# EAGLE design spacepwr (EAGLE 6.2)
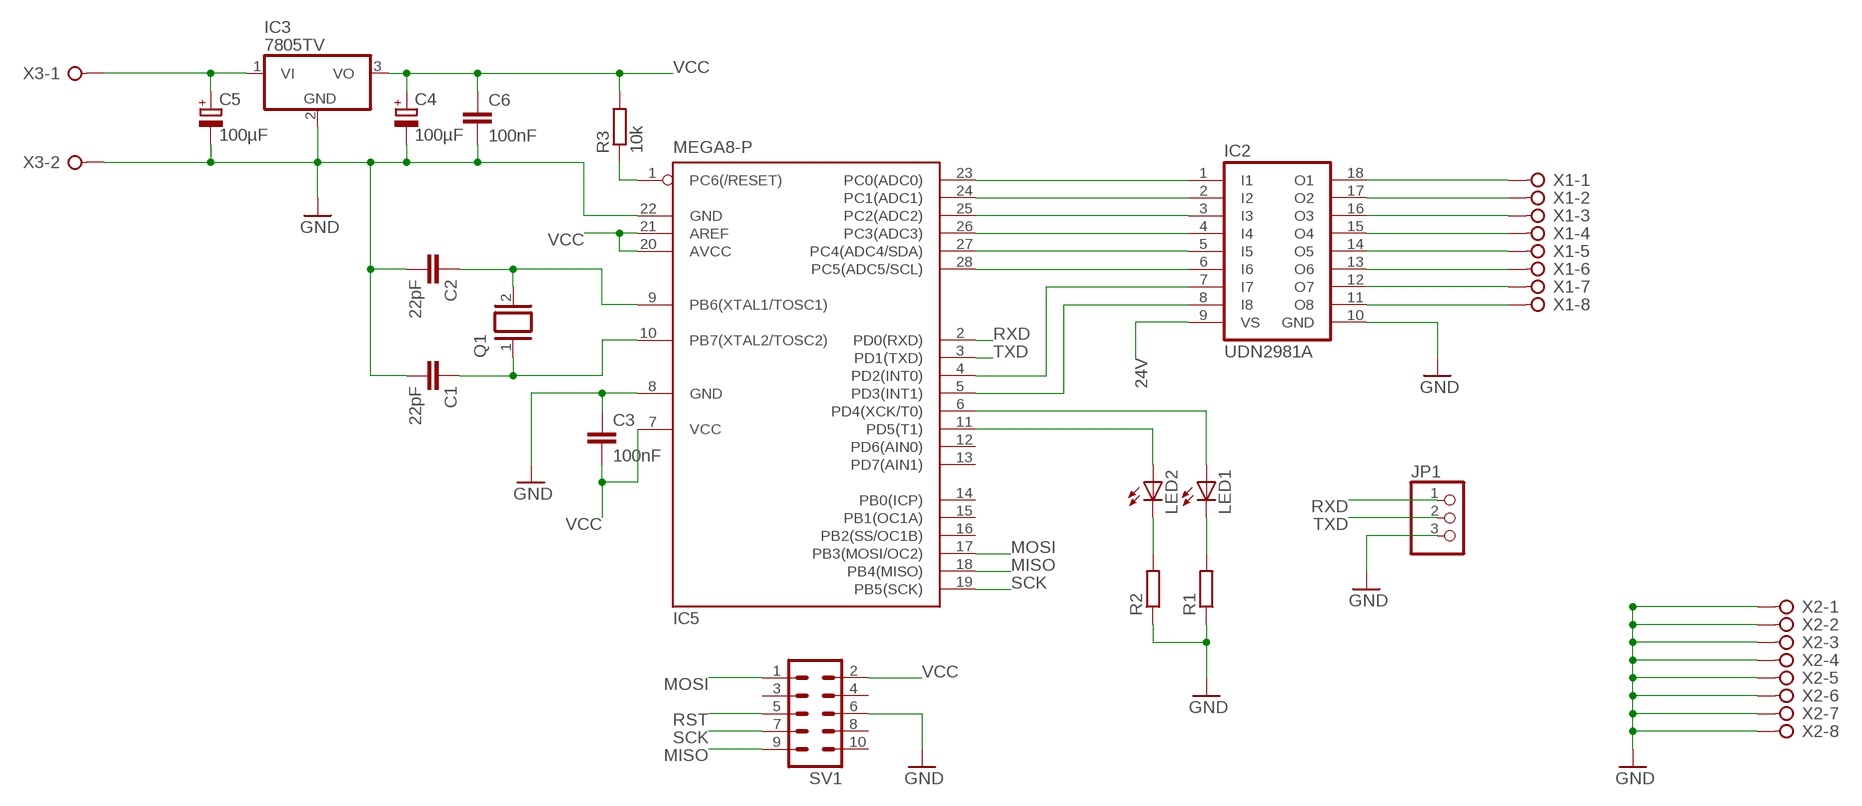
[diagram p0: schematic, sheet 1]

## Parts
C1  22pF  C-EU025-030X050  [C025-030X050]
C2  22pF  C-EU025-030X050  [C025-030X050]
C3  100nF  C-EU025-030X050  [C025-030X050]
C4  100µF  CPOL-EUE5-10.5  [E5-10,5]
C5  100µF  CPOL-EUE5-10.5  [E5-10,5]
C6  100nF  C-EU025-030X050  [C025-030X050]
IC2  UDN2981A  [DIL18]
IC3  7805TV  [TO220V]
IC5  MEGA8-P  [DIL28-3]
JP1  PINHD-1X3  [1X03]
LED1  LED5MM  [LED5MM]
LED2  LED5MM  [LED5MM]
Q1  XTAL/S  [QS]
R1  R-EU_0207/10  [0207/10]
R2  R-EU_0207/10  [0207/10]
R3  10k  R-EU_0207/10  [0207/10]
SV1  ML10  [ML10]
X1  W237-08P  [W237-8P]
X2  W237-08P  [W237-8P]
X3  W237-02P  [W237-132]

## Nets
24V: C5.+ IC2.9(VS) IC3.1(VI) X3.1
GND: C1.2 C2.2 C3.1 C4.- C5.- C6.2 IC2.10(GND) IC3.2(GND) IC5.8(GND) IC5.22(GND) JP1.3 R1.1 R2.1 SV1.6 X2.1 X2.2 X2.3 X2.4 X2.5 X2.6 X2.7 X2.8 X3.2
MISO: IC5.18(PB4(MISO)) SV1.9
MOSI: IC5.17(PB3(MOSI/OC2)) SV1.1
N$1: IC2.1(I1) IC5.23(PC0(ADC0))
N$2: IC2.2(I2) IC5.24(PC1(ADC1))
N$3: IC2.3(I3) IC5.25(PC2(ADC2))
N$4: IC2.4(I4) IC5.26(PC3(ADC3))
N$5: IC2.5(I5) IC5.27(PC4(ADC4/SDA))
N$6: IC2.6(I6) IC5.28(PC5(ADC5/SCL))
N$7: IC2.7(I7) IC5.4(PD2(INT0))
N$8: IC2.8(I8) IC5.5(PD3(INT1))
N$9: LED1.K(C) R1.2
N$10: IC5.6(PD4(XCK/T0)) LED1.A
N$11: IC2.18(O1) X1.1
N$12: IC5.11(PD5(T1)) LED2.A
N$13: LED2.K(C) R2.2
N$14: IC2.17(O2) X1.2
N$15: IC2.16(O3) X1.3
N$16: IC2.15(O4) X1.4
N$17: C1.1 IC5.10(PB7(XTAL2/TOSC2)) Q1.1
N$18: C2.1 IC5.9(PB6(XTAL1/TOSC1)) Q1.2
N$19: IC2.14(O5) X1.5
N$20: IC2.13(O6) X1.6
N$21: IC2.12(O7) X1.7
N$22: IC2.11(O8) X1.8
RST: IC5.1(PC6(/RESET)) R3.1 SV1.5
RXD: IC5.2(PD0(RXD)) JP1.1
SCK: IC5.19(PB5(SCK)) SV1.7
TXD: IC5.3(PD1(TXD)) JP1.2
VCC: C3.2 C4.+ C6.1 IC3.3(VO) IC5.7(VCC) IC5.20(AVCC) IC5.21(AREF) R3.2 SV1.2
Unconnected: IC5.12(PD6(AIN0)) IC5.13(PD7(AIN1)) IC5.14(PB0(ICP)) IC5.15(PB1(OC1A)) IC5.16(PB2(SS/OC1B)) SV1.3 SV1.4 SV1.8 SV1.10

## Library data of the parts
C1-C3 C6 = rcl:C-EU: CAPACITOR, European symbol
C4 C5 = rcl:CPOL-EU: POLARIZED CAPACITOR, European symbol
IC2 = uln-udn:UDN298*: DRIVER ARRAY Source: Allegro Microsystems Inc. / UDN2981-UDN2984.pdf
IC3 = linear:78*: Positive VOLTAGE REGULATOR Source: http://cache.national.com/ds/LM/LM78L05.pdf http://www.fairchildsemi.com/ds/LM/LM7805.pdf
IC5 = atmel:MEGA8-P: MICROCONTROLLER 8 Kbytes FLASH, 1 kbytes SRAM, 512 bytes EEPROM, USART, 4-channel 10 bit ADC, 2-channel 8 bit ADC Pin compatible with Atmega48, ATMega88, ATMega168 Source: avr.lbr; OC_FARNELL: unknown; OC_NEWARK: unknown
JP1 = pinhead:PINHD-1X3: PIN HEADER
LED1 LED2 = led:LED: LED OSRAM: - CHIPLED LG R971, LG N971, LY N971, LG Q971, LY Q971, LO R971, LY R971 LH N974, LH R974 LS Q976, LO Q976, LY Q976 LO Q996 - Hyper CHIPLED LW Q18S LB Q993, LB Q99A, LB R99A - SideLED LS A670, LO A670, LY A670, LG A670, LP A670 LB A673, LV A673, LT A673, LW A673 LH A674 LY A675 LS A676, LA A676, LO A676, LY A676, LW A676 LS A679, LY A679, LG A679 - Hyper Micro SIDELED® LS Y876, LA Y876, LO Y876, LY Y876 LT Y87S - SmartLED LW L88C, LW L88S LB L89C, LB L89S, LG L890 LS L89K, LO L89K, LY L89K LS L896, LA L896, LO L896, LY L896 - TOPLED LS T670, LO T670, LY T670, LG T670, LP T670 LSG T670, LSP T670, LSY T670, LOP T670, LYG T670 LG T671, LOG T671, LSG T671 LB T673, LV T673, LT T673, LW T673 LH T674 LS T676, LA T676, LO T676, LY T676, LB T676, LH T676, LSB T676, LW T676 LB T67C, LV T67C, LT T67C, LS T67K, LO T67K, LY T67K, LW E67C LS E67B, LA E67B, LO E67B, LY E67B, LB E67C, LV E67C, LT E67C LW T67C LS T679, LY T679, LG T679 LS T770, LO T770, LY T770, LG T770, LP T770 LB T773, LV T773, LT T773, LW T773 LH T774 LS E675, LA E675, LY E675, LS T675 LS T776, LA T776, LO T776, LY T776, LB T776 LHGB T686 LT T68C, LB T68C - Hyper Mini TOPLED® LB M676 - Mini TOPLED Santana® LG M470 LS M47K, LO M47K, LY M47K Source: http://www.osram.convergy.de LUXEON: - LUMILED® LXK2-PW12-R00, LXK2-PW12-S00, LXK2-PW14-U00, LXK2-PW14-V00 LXK2-PM12-R00, LXK2-PM12-S00, LXK2-PM14-U00 LXK2-PE12-Q00, LXK2-PE12-R00, LXK2-PE12-S00, LXK2-PE14-T00, LXK2-PE14-U00 LXK2-PB12-K00, LXK2-PB12-L00, LXK2-PB12-M00, LXK2-PB14-N00, LXK2-PB14-P00, LXK2-PB14-Q00 LXK2-PR12-L00, LXK2-PR12-M00, LXK2-PR14-Q00, LXK2-PR14-R00 LXK2-PD12-Q00, LXK2-PD12-R00, LXK2-PD12-S00 LXK2-PH12-R00, LXK2-PH12-S00 LXK2-PL12-P00, LXK2-PL12-Q00, LXK2-PL12-R00 Source: www.luxeon.com KINGBRIGHT: KA-3528ASYC Source: www.kingbright.com
Q1 = special:XTAL/S: CRYSTAL
R1-R3 = rcl:R-EU_: RESISTOR, European symbol
SV1 = con-ml:ML10: HARTING; OC_FARNELL: unknown; OC_NEWARK: unknown
X1 X2 = con-wago-508:W237-08P: WAGO SREW CLAMP; OC_FARNELL: unknown; OC_NEWARK: unknown
X3 = con-wago-508:W237-02P: WAGO SREW CLAMP; OC_FARNELL: unknown; OC_NEWARK: unknown

## Board
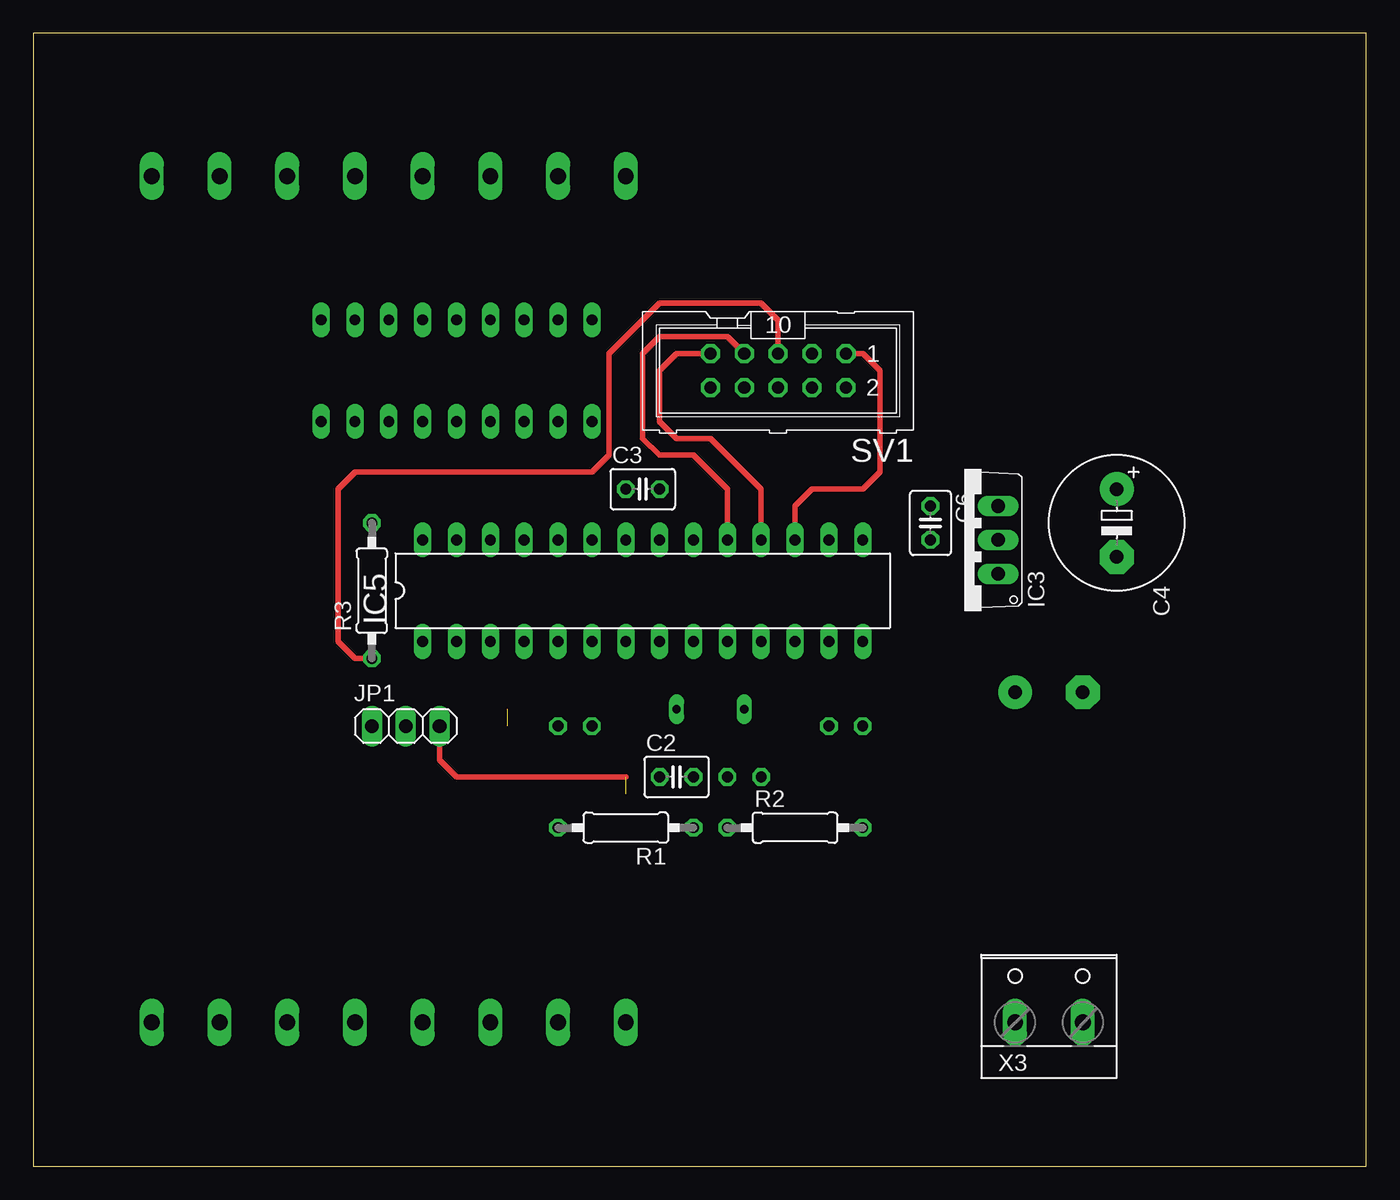
[diagram p1: board, top side]
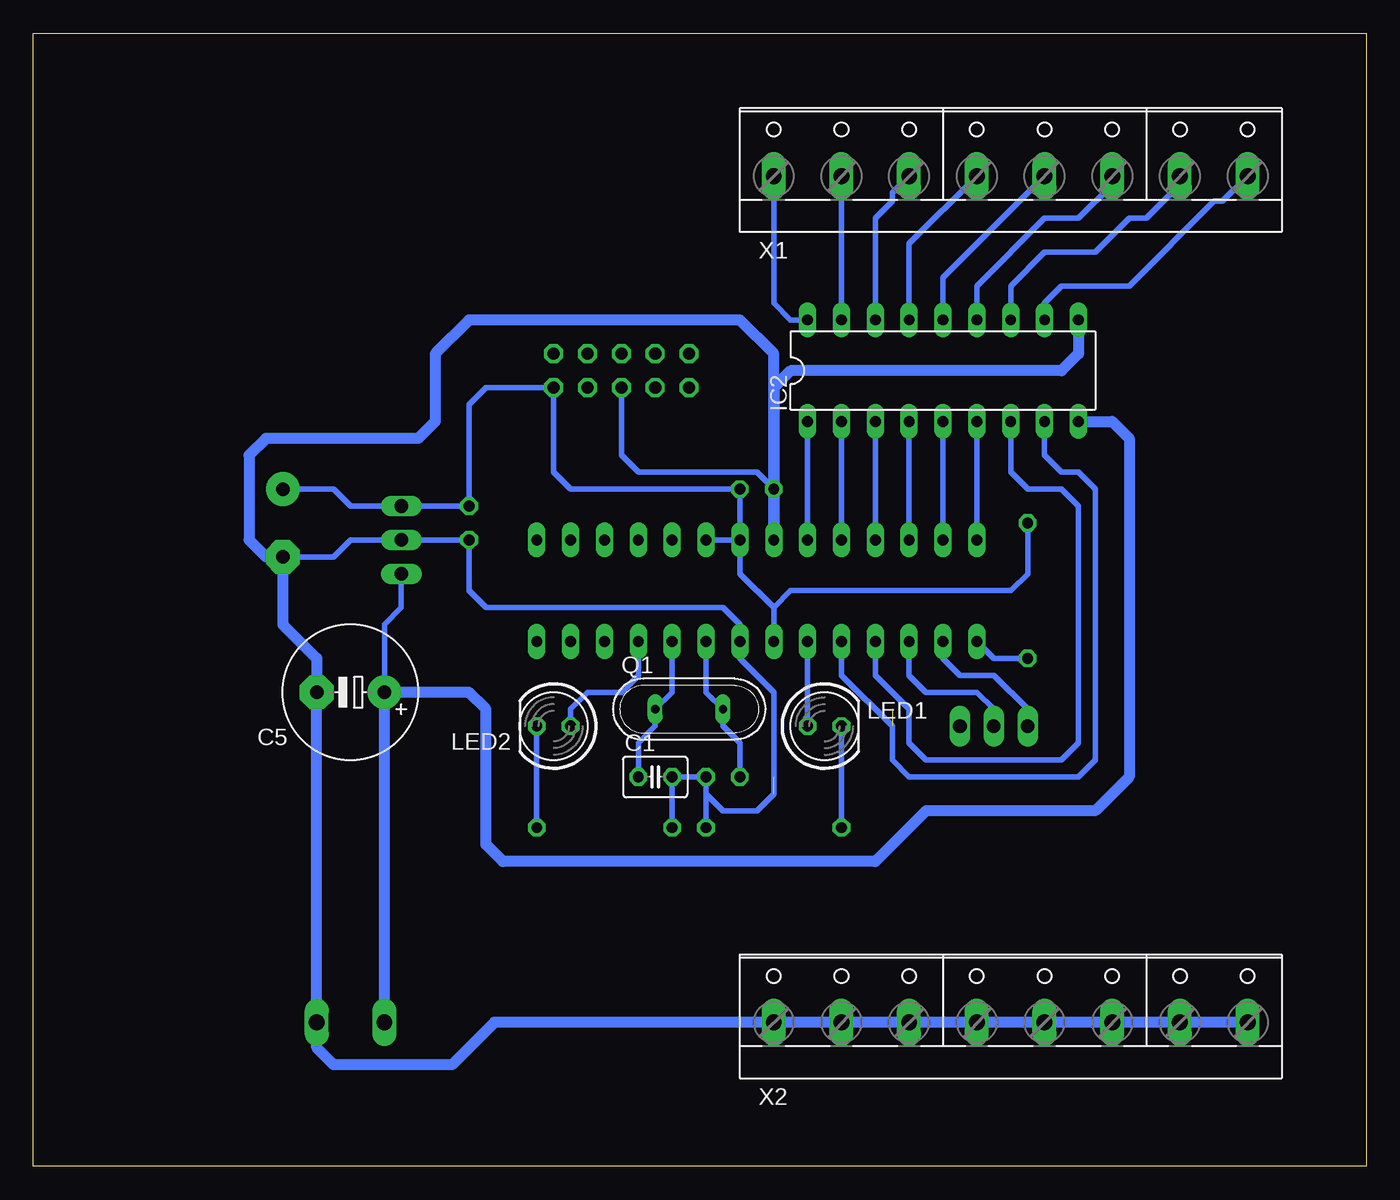
[diagram p2: board, bottom side, seen from below]

Size 100 x 85 mm. Coordinates in mm from the lower left corner, seen from the top.
Outline: 0,0 100,0 100,85 0,85 0,0
Copper layers (1*16): Top 0.035mm / dielectric 1.5mm / Bottom 0.035mm
Design rules: minimum track width 10mil, minimum drill 24mil, track to track 8mil, track to pad 8mil, pad to pad 8mil, via to via 8mil, smd to smd 8mil, copper to edge 40mil, drill to drill 8mil, minimum pad ring 10mil, minimum via ring 8mil, stop-mask expansion 4mil, vias tented up to drill 0mil, thermal gap 10mil

### Footprints (pad centres in the part's own frame; a part is rotated, then mirrored left to right if it is on the bottom)
C025-030X050 = drill 0.813 octagon: 1 -1.27,0; 2 1.27,0
E5-10,5 = drill 1.016 pad 2.54: + -2.54,0 | drill 1.016 pad 2.54 octagon: - 2.54,0
DIL18 = drill 0.813 long: 1 -10.16,-3.81; 2 -7.62,-3.81; 3 -5.08,-3.81; 4 -2.54,-3.81; 5 0,-3.81; 6 2.54,-3.81; 7 5.08,-3.81; 8 7.62,-3.81; 9 10.16,-3.81; 10 10.16,3.81; 11 7.62,3.81; 12 5.08,3.81; 13 2.54,3.81; 14 0,3.81; 15 -2.54,3.81; 16 -5.08,3.81; 17 -7.62,3.81; 18 -10.16,3.81
TO220V = drill 1.016 long: 1 -2.54,-2.54; 2 0,-2.54; 3 2.54,-2.54
DIL28-3 = drill 0.813 long: 1 -16.51,-3.81; 2 -13.97,-3.81; 3 -11.43,-3.81; 4 -8.89,-3.81; 5 -6.35,-3.81; 6 -3.81,-3.81; 7 -1.27,-3.81; 8 1.27,-3.81; 9 3.81,-3.81; 10 6.35,-3.81; 11 8.89,-3.81; 12 11.43,-3.81; 13 13.97,-3.81; 14 16.51,-3.81; 15 16.51,3.81; 16 13.97,3.81; 17 11.43,3.81; 18 8.89,3.81; 19 6.35,3.81; 20 3.81,3.81; 21 1.27,3.81; 22 -1.27,3.81; 23 -3.81,3.81; 24 -6.35,3.81; 25 -8.89,3.81; 26 -11.43,3.81; 27 -13.97,3.81; 28 -16.51,3.81
1X03 = drill 1.016 long: 1 -2.54,0; 2 0,0; 3 2.54,0
LED5MM = drill 0.813 octagon: A -1.27,0; K 1.27,0
QS = drill 0.61 long: 1 -2.54,0; 2 2.54,0
0207/10 = drill 0.813 octagon: 1 -5.08,0; 2 5.08,0
ML10 = drill 0.914 octagon: 1 -5.08,-1.27; 2 -5.08,1.27; 3 -2.54,-1.27; 4 -2.54,1.27; 5 0,-1.27; 6 0,1.27; 7 2.54,-1.27; 8 2.54,1.27; 9 5.08,-1.27; 10 5.08,1.27
W237-8P = drill 1.194 long: 1 -17.78,-0.635; 2 -12.7,-0.635; 3 -7.62,-0.635; 4 -2.54,-0.635; 5 2.54,-0.635; 6 7.62,-0.635; 7 12.7,-0.635; 8 17.78,-0.635
W237-132 = drill 1.194 long: 1 -2.54,-0.635; 2 2.54,-0.635

### Placement (x,y rotation side)
C1  53.34,29.21 0 bottom
C2  48.26,29.21 0 top
C3  45.72,50.8 0 top
C4  81.28,48.26 270 top
C5  76.2,35.56 180 bottom
C6  67.31,48.26 270 top
IC2  31.75,59.69 0 bottom
IC3  69.85,46.99 90 top
IC5  45.72,43.18 0 top
JP1  27.94,33.02 0 top
LED1  40.64,33.02 0 bottom
LED2  60.96,33.02 180 bottom
Q1  50.8,34.29 0 bottom
R1  44.45,25.4 180 top
R2  57.15,25.4 0 top
R3  25.4,43.18 90 top
SV1  55.88,59.69 180 top
X1  26.67,74.93 0 bottom
X2  26.67,11.43 0 bottom
X3  76.2,11.43 0 top

### Tracks (layer width: path | path; a pad name or v marks a point on that pad's centre or on a via)
24V
  Bottom 0.406: IC3.1 72.39,41.91 73.66,40.64 C5.+
  Bottom 0.813: IC2.9 19.05,55.88 17.78,54.61 17.78,29.21 20.32,26.67 33.02,26.67 36.83,22.86 64.77,22.86 66.04,24.13 66.04,34.29 67.31,35.56 C5.+ X3.1
GND  (1 unrouted)
  Top 0.406: JP1.3 30.48,30.48 31.75,29.21 44.45,29.21
  Bottom 0.406: C4.- 77.47,45.72 76.2,46.99 IC3.2 C6.2 67.31,43.18 66.04,41.91 48.26,41.91 46.99,40.64 IC5.8 46.99,38.1 44.45,35.56 44.45,27.94 45.72,26.67 48.26,26.67 49.53,27.94 C2.2 | C2.2 C1.2 R2.1 | C2.2 R1.1 | C3.1 45.72,52.07 54.61,52.07 55.88,53.34 SV1.6 | C3.1 44.45,58.42 44.45,60.96 | IC5.22 C3.1
  Bottom 0.813: IC2.10 21.59,60.96 22.86,59.69 43.18,59.69 44.45,58.42 IC5.22 44.45,60.96 46.99,63.5 67.31,63.5 69.85,60.96 69.85,55.88 71.12,54.61 82.55,54.61 83.82,53.34 83.82,46.99 82.55,45.72 C4.- 81.28,40.64 78.74,38.1 C5.- X3.2 78.74,8.89 77.47,7.62 68.58,7.62 65.41,10.79 X2.1 X2.2 X2.3 X2.4 X2.5 X2.6 X2.7 X2.8
MISO
  Top 0.406: IC5.18 54.61,50.8 50.8,54.61 48.26,54.61 46.99,55.88 46.99,59.69 48.26,60.96 SV1.9
MOSI
  Top 0.406: IC5.17 57.15,49.53 58.42,50.8 62.23,50.8 63.5,52.07 63.5,59.69 62.23,60.96 SV1.1
N$1
  Bottom 0.406: IC2.1 IC5.23
N$2
  Bottom 0.406: IC5.24 IC2.2
N$3
  Bottom 0.406: IC5.25 IC2.3
N$4
  Bottom 0.406: IC5.26 IC2.4
N$5
  Bottom 0.406: IC5.27 IC2.5
N$6
  Bottom 0.406: IC2.6 IC5.28
N$7
  Bottom 0.406: IC5.4 36.83,36.83 34.29,34.29 34.29,31.75 33.02,30.48 22.86,30.48 21.59,31.75 21.59,49.53 22.86,50.8 25.4,50.8 26.67,52.07 IC2.7
N$8  (1 unrouted)
  Bottom 0.406: IC2.8 24.13,53.34 22.86,52.07 21.59,52.07 20.32,50.8 20.32,30.48 21.59,29.21 34.29,29.21 35.56,30.48 35.56,33.02 39.37,36.83 IC5.5
N$9
  Bottom 0.406: R1.2 LED1.K
N$10
  Bottom 0.406: LED1.A IC5.6
N$11
  Bottom 0.406: IC2.18 43.18,63.5 44.45,64.77 X1.1
N$12
  Bottom 0.406: LED2.A 59.69,34.29 58.42,35.56 55.88,35.56 54.61,36.83 IC5.11
N$13
  Bottom 0.406: R2.2 LED2.K
N$14
  Bottom 0.406: IC2.17 X1.2
N$15
  Bottom 0.406: IC2.16 36.83,71.12 35.56,72.39 35.56,73.03 X1.3
N$16
  Bottom 0.406: IC2.15 34.29,69.22 X1.4
N$17
  Bottom 0.406: IC5.10 52.07,35.56 Q1.1 53.34,33.02 54.61,31.75 C1.1
N$18
  Bottom 0.406: IC5.9 49.53,35.56 Q1.2 48.26,33.02 46.99,31.75 C2.1
N$19
  Bottom 0.406: IC2.14 31.75,66.67 X1.5
N$20
  Bottom 0.406: IC2.13 29.21,66.04 24.13,71.12 21.59,71.12 19.05,73.66 X1.6
N$21
  Bottom 0.406: IC2.12 26.67,66.04 24.13,68.58 20.32,68.58 17.78,71.12 16.51,71.12 13.97,73.66 X1.7
N$22
  Bottom 0.406: X1.8 10.79,72.39 11.43,72.39 17.78,66.04 22.86,66.04 24.13,64.77 IC2.11
RST
  Top 0.406: SV1.5 55.88,63.5 54.61,64.77 46.99,64.77 43.18,60.96 43.18,53.34 41.91,52.07 24.13,52.07 22.86,50.8 22.86,39.37 24.13,38.1 R3.1
  Bottom 0.406: R3.1 27.94,38.1 IC5.1
RXD
  Bottom 0.406: JP1.1 25.4,34.29 27.94,36.83 30.48,36.83 31.75,38.1 IC5.2
SCK
  Top 0.406: IC5.19 52.07,50.8 49.53,53.34 46.99,53.34 45.72,54.61 45.72,60.96 46.99,62.23 52.07,62.23 SV1.7
TXD
  Bottom 0.406: JP1.2 27.94,34.29 29.21,35.56 33.02,35.56 34.29,36.83 IC5.3
VCC
  Bottom 0.406: C4.+ 77.47,50.8 76.2,49.53 IC3.3 C6.1 67.31,57.15 66.04,58.42 SV1.2 60.96,52.07 59.69,50.8 C3.2 IC5.21 | IC5.21 IC5.20 | IC5.21 46.99,44.45 44.45,41.91 | 44.45,41.91 IC5.7 | R3.2 25.4,44.45 26.67,43.18 43.18,43.18 44.45,41.91